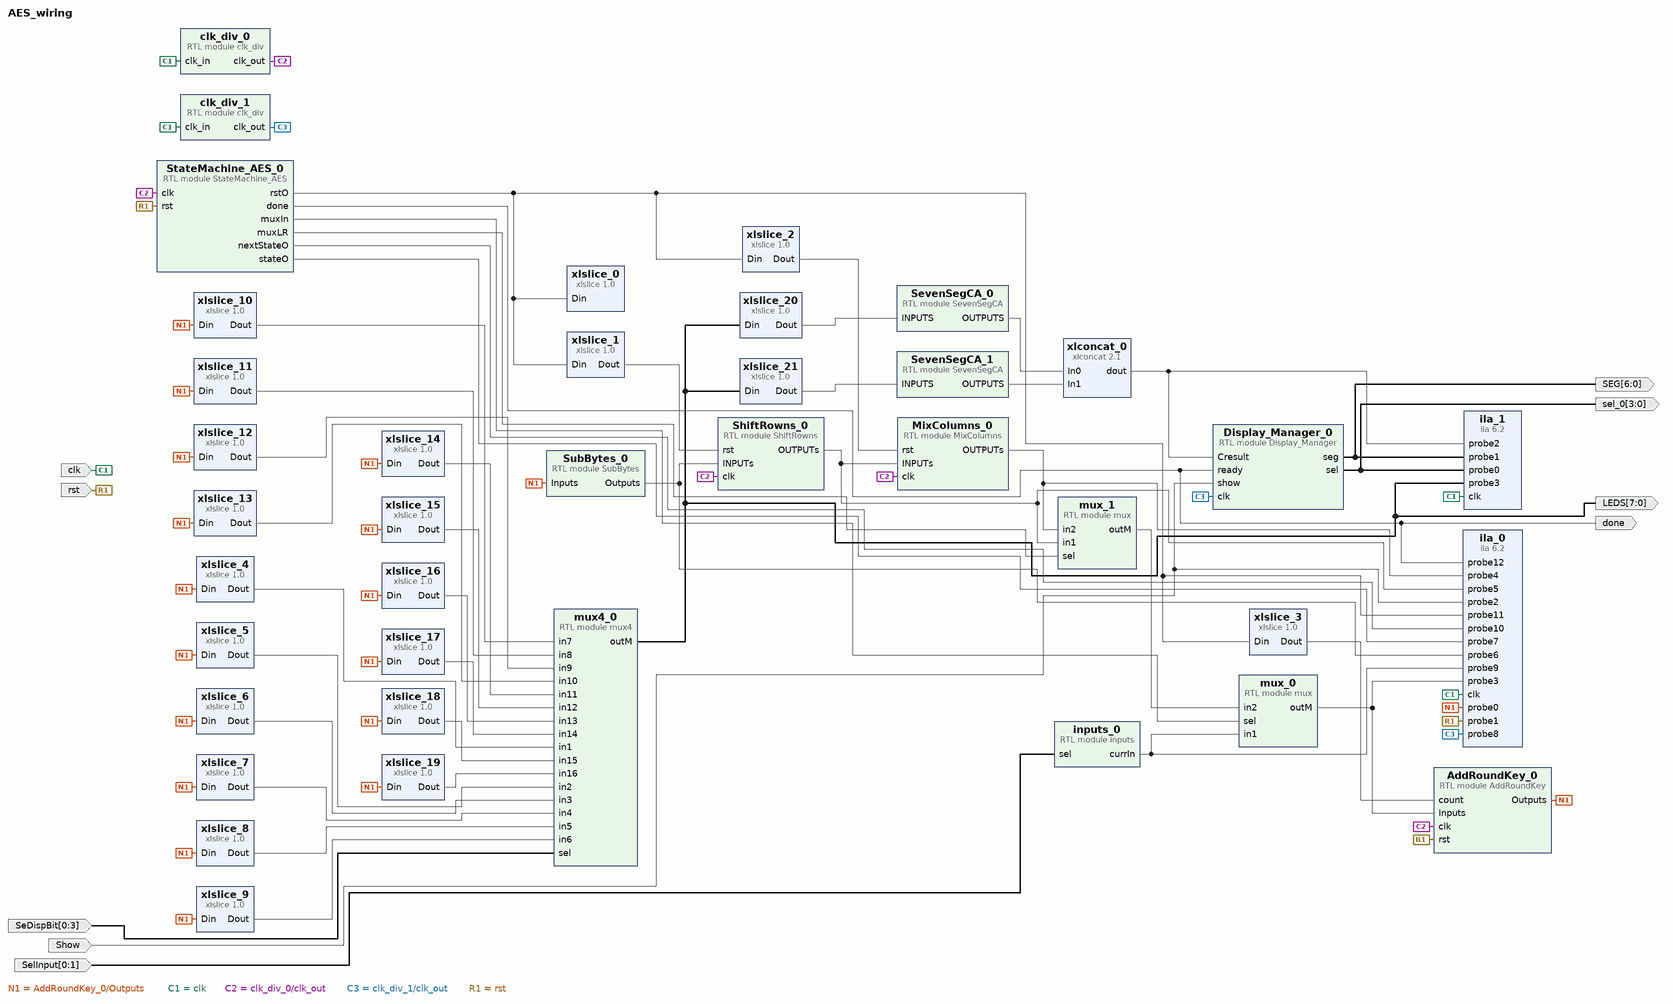
[diagram p0: block diagram of the top level]
# Vivado block design AES_wiring, xc7a35tcpg236-1, Vivado 2023.1
create_bd_design AES_wiring

create_bd_port -dir O -from 6 -to 0 -type data SEG
create_bd_port -dir O -from 3 -to 0 sel_0
create_bd_port -dir I -from 0 -to 1 -type data SelInput
create_bd_port -dir I -type clk clk
set_property -dict {CONFIG.FREQ_HZ 4000000} [get_bd_ports clk]
create_bd_port -dir I rst
create_bd_port -dir I Show
create_bd_port -dir I -from 0 -to 3 -type data SeDispBit
create_bd_port -dir O done
create_bd_port -dir O -from 7 -to 0 -type data LEDS

create_bd_cell -type ip -vlnv xilinx.com:ip:xlconcat:2.1 xlconcat_0
set_property -dict {CONFIG.IN0_WIDTH 7 CONFIG.IN1_WIDTH 7} [get_bd_cells xlconcat_0]
create_bd_cell -type ip -vlnv xilinx.com:ip:xlslice:1.0 xlslice_0
set_property -dict {CONFIG.DIN_FROM 0 CONFIG.DIN_TO 0 CONFIG.DIN_WIDTH 4} [get_bd_cells xlslice_0]
create_bd_cell -type ip -vlnv xilinx.com:ip:xlslice:1.0 xlslice_1
set_property -dict {CONFIG.DIN_FROM 1 CONFIG.DIN_TO 1 CONFIG.DIN_WIDTH 4} [get_bd_cells xlslice_1]
create_bd_cell -type ip -vlnv xilinx.com:ip:xlslice:1.0 xlslice_2
set_property -dict {CONFIG.DIN_FROM 2 CONFIG.DIN_TO 2 CONFIG.DIN_WIDTH 4} [get_bd_cells xlslice_2]
create_bd_cell -type ip -vlnv xilinx.com:ip:xlslice:1.0 xlslice_3
set_property -dict {CONFIG.DIN_FROM 3 CONFIG.DIN_TO 3 CONFIG.DIN_WIDTH 4} [get_bd_cells xlslice_3]
create_bd_cell -type ip -vlnv xilinx.com:ip:xlslice:1.0 xlslice_4
set_property -dict {CONFIG.DIN_FROM 7 CONFIG.DIN_TO 0 CONFIG.DIN_WIDTH 128} [get_bd_cells xlslice_4]
create_bd_cell -type ip -vlnv xilinx.com:ip:xlslice:1.0 xlslice_5
set_property -dict {CONFIG.DIN_FROM 15 CONFIG.DIN_TO 8 CONFIG.DIN_WIDTH 128} [get_bd_cells xlslice_5]
create_bd_cell -type ip -vlnv xilinx.com:ip:xlslice:1.0 xlslice_6
set_property -dict {CONFIG.DIN_FROM 23 CONFIG.DIN_TO 16 CONFIG.DIN_WIDTH 128} [get_bd_cells xlslice_6]
create_bd_cell -type ip -vlnv xilinx.com:ip:xlslice:1.0 xlslice_7
set_property -dict {CONFIG.DIN_FROM 31 CONFIG.DIN_TO 24 CONFIG.DIN_WIDTH 128} [get_bd_cells xlslice_7]
create_bd_cell -type ip -vlnv xilinx.com:ip:xlslice:1.0 xlslice_8
set_property -dict {CONFIG.DIN_FROM 39 CONFIG.DIN_TO 32 CONFIG.DIN_WIDTH 128 CONFIG.DOUT_WIDTH 8} [get_bd_cells xlslice_8]
create_bd_cell -type ip -vlnv xilinx.com:ip:xlslice:1.0 xlslice_9
set_property -dict {CONFIG.DIN_FROM 47 CONFIG.DIN_TO 40 CONFIG.DIN_WIDTH 128} [get_bd_cells xlslice_9]
create_bd_cell -type ip -vlnv xilinx.com:ip:xlslice:1.0 xlslice_10
set_property -dict {CONFIG.DIN_FROM 55 CONFIG.DIN_TO 48 CONFIG.DIN_WIDTH 128} [get_bd_cells xlslice_10]
create_bd_cell -type ip -vlnv xilinx.com:ip:xlslice:1.0 xlslice_11
set_property -dict {CONFIG.DIN_FROM 63 CONFIG.DIN_TO 56 CONFIG.DIN_WIDTH 128} [get_bd_cells xlslice_11]
create_bd_cell -type ip -vlnv xilinx.com:ip:xlslice:1.0 xlslice_12
set_property -dict {CONFIG.DIN_FROM 71 CONFIG.DIN_TO 64 CONFIG.DIN_WIDTH 128} [get_bd_cells xlslice_12]
create_bd_cell -type ip -vlnv xilinx.com:ip:xlslice:1.0 xlslice_13
set_property -dict {CONFIG.DIN_FROM 79 CONFIG.DIN_TO 72 CONFIG.DIN_WIDTH 128} [get_bd_cells xlslice_13]
create_bd_cell -type ip -vlnv xilinx.com:ip:xlslice:1.0 xlslice_14
set_property -dict {CONFIG.DIN_FROM 87 CONFIG.DIN_TO 80 CONFIG.DIN_WIDTH 128} [get_bd_cells xlslice_14]
create_bd_cell -type ip -vlnv xilinx.com:ip:xlslice:1.0 xlslice_15
set_property -dict {CONFIG.DIN_FROM 95 CONFIG.DIN_TO 88 CONFIG.DIN_WIDTH 128} [get_bd_cells xlslice_15]
create_bd_cell -type ip -vlnv xilinx.com:ip:xlslice:1.0 xlslice_16
set_property -dict {CONFIG.DIN_FROM 103 CONFIG.DIN_TO 96 CONFIG.DIN_WIDTH 128} [get_bd_cells xlslice_16]
create_bd_cell -type ip -vlnv xilinx.com:ip:xlslice:1.0 xlslice_17
set_property -dict {CONFIG.DIN_FROM 111 CONFIG.DIN_TO 104 CONFIG.DIN_WIDTH 128} [get_bd_cells xlslice_17]
create_bd_cell -type ip -vlnv xilinx.com:ip:xlslice:1.0 xlslice_18
set_property -dict {CONFIG.DIN_FROM 119 CONFIG.DIN_TO 112 CONFIG.DIN_WIDTH 128} [get_bd_cells xlslice_18]
create_bd_cell -type ip -vlnv xilinx.com:ip:xlslice:1.0 xlslice_19
set_property -dict {CONFIG.DIN_FROM 127 CONFIG.DIN_TO 120 CONFIG.DIN_WIDTH 128} [get_bd_cells xlslice_19]
create_bd_cell -type ip -vlnv xilinx.com:ip:xlslice:1.0 xlslice_20
set_property -dict {CONFIG.DIN_FROM 3 CONFIG.DIN_TO 0 CONFIG.DIN_WIDTH 8} [get_bd_cells xlslice_20]
create_bd_cell -type ip -vlnv xilinx.com:ip:xlslice:1.0 xlslice_21
set_property -dict {CONFIG.DIN_FROM 7 CONFIG.DIN_TO 4 CONFIG.DIN_WIDTH 8} [get_bd_cells xlslice_21]
create_bd_cell -type module -reference mux mux_1
set_property -dict {CONFIG.N 7} [get_bd_cells mux_1]
create_bd_cell -type ip -vlnv xilinx.com:ip:ila:6.2 ila_0
set_property -dict [list \
  CONFIG.ALL_PROBE_SAME_MU_CNT 2 \
  CONFIG.C_ADV_TRIGGER false \
  CONFIG.C_DATA_DEPTH 2048 \
  CONFIG.C_EN_STRG_QUAL 1 \
  CONFIG.C_MONITOR_TYPE Native \
  CONFIG.C_NUM_OF_PROBES 13 \
  CONFIG.C_PROBE0_WIDTH 128 \
  CONFIG.C_PROBE10_WIDTH 3 \
  CONFIG.C_PROBE11_WIDTH 4 \
  CONFIG.C_PROBE3_WIDTH 128 \
  CONFIG.C_PROBE4_WIDTH 128 \
  CONFIG.C_PROBE5_WIDTH 128 \
  CONFIG.C_PROBE7_WIDTH 3 \
  CONFIG.C_PROBE9_TYPE 0 \
  CONFIG.C_PROBE9_WIDTH 128 \
  CONFIG.C_TRIGIN_EN false \
] [get_bd_cells ila_0]
create_bd_cell -type module -reference SubBytes SubBytes_0
create_bd_cell -type module -reference inputs inputs_0
create_bd_cell -type module -reference mux4 mux4_0
set_property -dict {CONFIG.N 3} [get_bd_cells mux4_0]
create_bd_cell -type module -reference mux mux_0
set_property -dict {CONFIG.N 7} [get_bd_cells mux_0]
create_bd_cell -type ip -vlnv xilinx.com:ip:ila:6.2 ila_1
set_property -dict [list \
  CONFIG.C_MONITOR_TYPE Native \
  CONFIG.C_NUM_OF_PROBES 4 \
  CONFIG.C_PROBE0_WIDTH 4 \
  CONFIG.C_PROBE1_WIDTH 7 \
  CONFIG.C_PROBE2_WIDTH 14 \
] [get_bd_cells ila_1]
create_bd_cell -type module -reference clk_div clk_div_1
set_property -dict {CONFIG.F 500000} [get_bd_cells clk_div_1]
create_bd_cell -type module -reference ShiftRowns ShiftRowns_0
create_bd_cell -type module -reference SevenSegCA SevenSegCA_0
create_bd_cell -type module -reference SevenSegCA SevenSegCA_1
create_bd_cell -type module -reference Display_Manager Display_Manager_0
create_bd_cell -type module -reference clk_div clk_div_0
set_property -dict {CONFIG.F 4} [get_bd_cells clk_div_0]
create_bd_cell -type module -reference AddRoundKey AddRoundKey_0
create_bd_cell -type module -reference StateMachine_AES StateMachine_AES_0
create_bd_cell -type module -reference MixColumns MixColumns_0

# ---- connections ----

connect_bd_net [get_bd_pins AddRoundKey_0/Outputs] \
  [get_bd_pins xlslice_4/Din] [get_bd_pins xlslice_5/Din] [get_bd_pins xlslice_6/Din] [get_bd_pins xlslice_7/Din] \
  [get_bd_pins xlslice_8/Din] [get_bd_pins xlslice_9/Din] [get_bd_pins xlslice_10/Din] [get_bd_pins xlslice_11/Din] \
  [get_bd_pins xlslice_12/Din] [get_bd_pins xlslice_13/Din] [get_bd_pins xlslice_14/Din] [get_bd_pins xlslice_15/Din] \
  [get_bd_pins xlslice_16/Din] [get_bd_pins xlslice_17/Din] [get_bd_pins xlslice_18/Din] [get_bd_pins xlslice_19/Din] \
  [get_bd_pins ila_0/probe0] [get_bd_pins SubBytes_0/Inputs]
connect_bd_net [get_bd_pins Display_Manager_0/seg] [get_bd_ports SEG] [get_bd_pins ila_1/probe1]
connect_bd_net [get_bd_pins Display_Manager_0/sel] [get_bd_ports sel_0] [get_bd_pins ila_1/probe0]
connect_bd_net -net MixColumns_0_output [get_bd_pins MixColumns_0/OUTPUTs] [get_bd_pins mux_1/in2] [get_bd_pins ila_0/probe4]
connect_bd_net [get_bd_ports SeDispBit] [get_bd_pins mux4_0/sel]
connect_bd_net [get_bd_ports SelInput] [get_bd_pins inputs_0/sel]
connect_bd_net -net SevenSegCA_0_Output [get_bd_pins SevenSegCA_0/OUTPUTS] [get_bd_pins xlconcat_0/In0]
connect_bd_net -net SevenSegCA_1_Output [get_bd_pins SevenSegCA_1/OUTPUTS] [get_bd_pins xlconcat_0/In1]
connect_bd_net [get_bd_pins ShiftRowns_0/OUTPUTs] [get_bd_pins mux_1/in1] [get_bd_pins ila_0/probe5] [get_bd_pins MixColumns_0/INPUTs]
connect_bd_net [get_bd_ports Show] [get_bd_pins ila_0/probe2] [get_bd_pins Display_Manager_0/show]
connect_bd_net [get_bd_pins StateMachine_AES_0/done] [get_bd_pins ila_0/probe12] [get_bd_pins Display_Manager_0/ready] [get_bd_ports done]
connect_bd_net [get_bd_pins StateMachine_AES_0/muxIn] [get_bd_pins mux_0/sel]
connect_bd_net [get_bd_pins StateMachine_AES_0/muxLR] [get_bd_pins mux_1/sel]
connect_bd_net [get_bd_pins StateMachine_AES_0/nextStateO] [get_bd_pins ila_0/probe10]
connect_bd_net [get_bd_pins StateMachine_AES_0/rstO] \
  [get_bd_pins xlslice_0/Din] [get_bd_pins xlslice_1/Din] [get_bd_pins xlslice_2/Din] [get_bd_pins xlslice_3/Din] \
  [get_bd_pins ila_0/probe11]
connect_bd_net [get_bd_pins StateMachine_AES_0/stateO] [get_bd_pins ila_0/probe7]
connect_bd_net [get_bd_pins SubBytes_0/Outputs] [get_bd_pins ila_0/probe6] [get_bd_pins ShiftRowns_0/INPUTs]
connect_bd_net [get_bd_ports clk] [get_bd_pins clk_div_0/clk_in] [get_bd_pins ila_0/clk] [get_bd_pins ila_1/clk] [get_bd_pins clk_div_1/clk_in]
connect_bd_net [get_bd_pins clk_div_0/clk_out] \
  [get_bd_pins ShiftRowns_0/clk] [get_bd_pins AddRoundKey_0/clk] [get_bd_pins StateMachine_AES_0/clk] \
  [get_bd_pins MixColumns_0/clk]
connect_bd_net [get_bd_pins clk_div_1/clk_out] [get_bd_pins ila_0/probe8] [get_bd_pins Display_Manager_0/clk]
connect_bd_net [get_bd_pins inputs_0/currIn] [get_bd_pins mux_0/in1] [get_bd_pins ila_0/probe9]
connect_bd_net [get_bd_pins mux4_0/outM] [get_bd_pins xlslice_20/Din] [get_bd_pins xlslice_21/Din] [get_bd_ports LEDS] [get_bd_pins ila_1/probe3]
connect_bd_net [get_bd_pins mux_0/outM] [get_bd_pins ila_0/probe3] [get_bd_pins AddRoundKey_0/Inputs]
connect_bd_net [get_bd_pins mux_1/outM] [get_bd_pins mux_0/in2]
connect_bd_net [get_bd_ports rst] [get_bd_pins ila_0/probe1] [get_bd_pins AddRoundKey_0/rst] [get_bd_pins StateMachine_AES_0/rst]
connect_bd_net [get_bd_pins xlconcat_0/dout] [get_bd_pins ila_1/probe2] [get_bd_pins Display_Manager_0/Cresult]
connect_bd_net [get_bd_pins xlslice_10/Dout] [get_bd_pins mux4_0/in7]
connect_bd_net [get_bd_pins xlslice_11/Dout] [get_bd_pins mux4_0/in8]
connect_bd_net [get_bd_pins xlslice_12/Dout] [get_bd_pins mux4_0/in9]
connect_bd_net [get_bd_pins xlslice_13/Dout] [get_bd_pins mux4_0/in10]
connect_bd_net [get_bd_pins xlslice_14/Dout] [get_bd_pins mux4_0/in11]
connect_bd_net [get_bd_pins xlslice_15/Dout] [get_bd_pins mux4_0/in12]
connect_bd_net [get_bd_pins xlslice_16/Dout] [get_bd_pins mux4_0/in13]
connect_bd_net [get_bd_pins xlslice_17/Dout] [get_bd_pins mux4_0/in14]
connect_bd_net [get_bd_pins xlslice_18/Dout] [get_bd_pins mux4_0/in15]
connect_bd_net [get_bd_pins xlslice_19/Dout] [get_bd_pins mux4_0/in16]
connect_bd_net [get_bd_pins xlslice_1/Dout] [get_bd_pins ShiftRowns_0/rst]
connect_bd_net [get_bd_pins xlslice_20/Dout] [get_bd_pins SevenSegCA_0/INPUTS]
connect_bd_net [get_bd_pins xlslice_21/Dout] [get_bd_pins SevenSegCA_1/INPUTS]
connect_bd_net [get_bd_pins xlslice_2/Dout] [get_bd_pins MixColumns_0/rst]
connect_bd_net [get_bd_pins xlslice_3/Dout] [get_bd_pins AddRoundKey_0/count]
connect_bd_net [get_bd_pins xlslice_4/Dout] [get_bd_pins mux4_0/in1]
connect_bd_net [get_bd_pins xlslice_5/Dout] [get_bd_pins mux4_0/in2]
connect_bd_net [get_bd_pins xlslice_6/Dout] [get_bd_pins mux4_0/in3]
connect_bd_net [get_bd_pins xlslice_7/Dout] [get_bd_pins mux4_0/in4]
connect_bd_net [get_bd_pins xlslice_8/Dout] [get_bd_pins mux4_0/in5]
connect_bd_net [get_bd_pins xlslice_9/Dout] [get_bd_pins mux4_0/in6]

validate_bd_design
save_bd_design
